# Altium schematic sheet LEDs_Switches.SchDoc: Evaluation Board 3.2
size A3; Organization: Toradex AG; Address1: Altsagenstrasse 5; Address2: Horw; Address3: 6048; Address4: Switzerland; DocumentNumber: 21; Revision: V3.2; SheetNumber: 21; SheetTotal: 23; PageSetup: Record=PageOptions|CenterHorizontal=True|CenterVertical=True|PrintScale=0.73|XCorrection=1.00|YCorrection=1.00|PrintKind=0|BorderSize=5000000|LeftOffset=0|BottomOffset=0|Orientation=2|PaperLength=1000|PaperWidth=1000|Scale=100|PaperSource=7|PrintQuality=-4|MediaType=1|DitherType=10|PaperKind=A4|PrintScaleMode=1
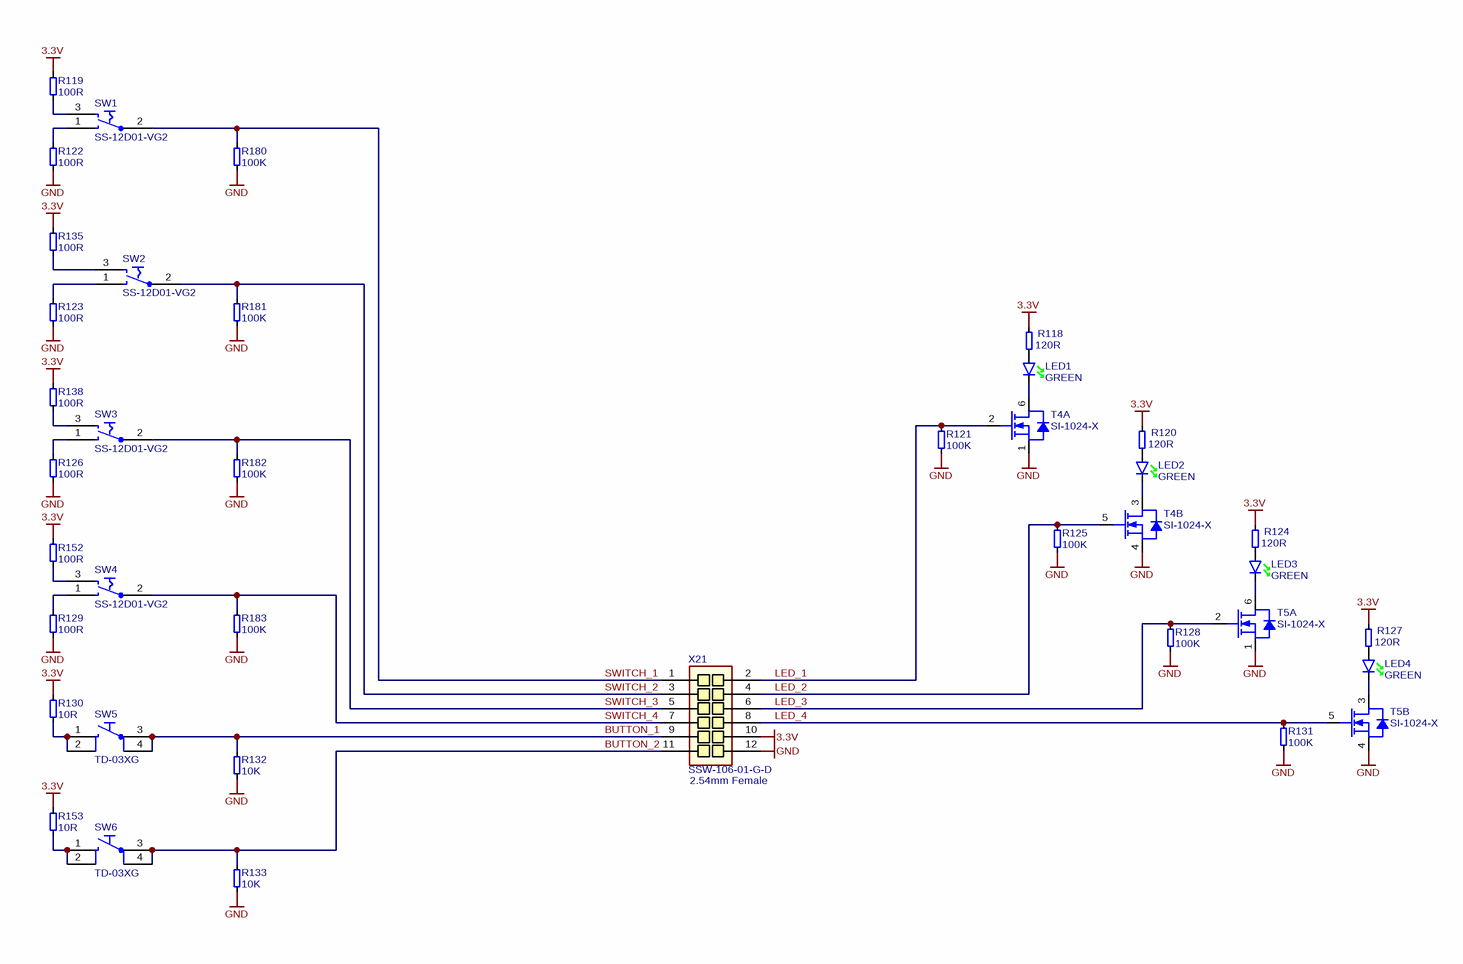
[diagram p0: LEDs_Switches.SchDoc]

## Parts
LED1  Color: GREEN  [T_Osram_T670_GREEN]  (hidden comment: LG T670-K1L2-1)
LED2  Color: GREEN  [T_Osram_T670_GREEN]  (hidden comment: LG T670-K1L2-1)
LED3  Color: GREEN  [T_Osram_T670_GREEN]  (hidden comment: LG T670-K1L2-1)
LED4  Color: GREEN  [T_Osram_T670_GREEN]  (hidden comment: LG T670-K1L2-1)
R118  120R  [T_RESC0603X30N]
R119  100R  [T_RESC0603X30N]
R120  120R  [T_RESC0603X30N]
R121  100K  [T_RESC0603X30N]
R122  100R  [T_RESC0603X30N]
R123  100R  [T_RESC0603X30N]
R124  120R  [T_RESC0603X30N]
R125  100K  [T_RESC0603X30N]
R126  100R  [T_RESC0603X30N]
R127  120R  [T_RESC0603X30N]
R128  100K  [T_RESC0603X30N]
R129  100R  [T_RESC0603X30N]
R130  10R  [T_RESC0603X30N]
R131  100K  [T_RESC0603X30N]
R132  10K  [T_RESC0603X30N]
R133  10K  [T_RESC0603X30N]
R135  100R  [T_RESC0603X30N]
R138  100R  [T_RESC0603X30N]
R152  100R  [T_RESC0603X30N]
R153  10R  [T_RESC0603X30N]
R180  100K  [T_RESC0603X30N]
R181  100K  [T_RESC0603X30N]
R182  100K  [T_RESC0603X30N]
R183  100K  [T_RESC0603X30N]
SW1  SS-12D01-VG2  [T_See-Plus_SS-12D01-VG2]
SW2  SS-12D01-VG2  [T_See-Plus_SS-12D01-VG2]
SW3  SS-12D01-VG2  [T_See-Plus_SS-12D01-VG2]
SW4  SS-12D01-VG2  [T_See-Plus_SS-12D01-VG2]
SW5  TD-03XG  [T_WMF_TD-03XG]
SW6  TD-03XG  [T_WMF_TD-03XG]
T4  Manufacturer Part No.: SI-1024-X  [SOTFL50P160X60-6N]  (hidden comment: T-Vishay-SI-1024X-N)  (parts A,B of 2)
T5  Manufacturer Part No.: SI-1024-X  [SOTFL50P160X60-6N]  (hidden comment: T-Vishay-SI-1024X-N)  (parts A,B of 2)
X21  SSW-106-01-G-D  [T_Samtec_SSW-106-01-G-D]

## Nets
3.3V: R118.2 R119.2 R120.2 R124.2 R127.2 R130.2 R135.2 R138.2 R152.2 R153.2 X21.10
GND: R121.1 R122.1 R123.1 R125.1 R126.1 R128.1 R129.1 R131.1 R132.1 R133.1 R180.1 R181.1 R182.1 R183.1 T4.1(S) T4.4(S) T5.1(S) T5.4(S) X21.12
BUTTON_1: R132.2 SW5.3 SW5.4 X21.9
BUTTON_2: R133.2 SW6.3 SW6.4 X21.11
LED_1: R121.2 T4.2(G) X21.2
LED_2: R125.2 T4.5(G) X21.4
LED_3: R128.2 T5.2(G) X21.6
LED_4: R131.2 T5.5(G) X21.8
SWITCH_1: R180.2 SW1.2 X21.1
SWITCH_2: R181.2 SW2.2 X21.3
SWITCH_3: R182.2 SW3.2 X21.5
SWITCH_4: R183.2 SW4.2 X21.7
NetLED1_A: LED1.A R118.1
NetLED1_K: LED1.K T4.6(D)
NetLED2_A: LED2.A R120.1
NetLED2_K: LED2.K T4.3(D)
NetLED3_A: LED3.A R124.1
NetLED3_K: LED3.K T5.6(D)
NetLED4_A: LED4.A R127.1
NetLED4_K: LED4.K T5.3(D)
NetR119_1: R119.1 SW1.3
NetR122_2: R122.2 SW1.1
NetR123_2: R123.2 SW2.1
NetR126_2: R126.2 SW3.1
NetR129_2: R129.2 SW4.1
NetR130_1: R130.1 SW5.1 SW5.2
NetR135_1: R135.1 SW2.3
NetR138_1: R138.1 SW3.3
NetR152_1: R152.1 SW4.3
NetR153_1: R153.1 SW6.1 SW6.2

## Notes on the sheet
- (near X21) 2.54mm Female
- Title
- Size:
- Date:
- A3
- Number:
- Time:
- Revision:
- Sheet
- of
- File:

## Library data of the parts
LED1-LED4 = LED-Osram-T670-K1L2-1: LED green Osram LG T670-K1L2-1; Manufacturer Part N.: LG T670-K1L2-1; Manufacturer Name: Osram
R118 R120 R124 R127 = R-120R-63mW-5%-0603: Resistor 120 ohm 63mW 5% 0603; Rating: 63mW; Tolerance: 5%; Value: 120R
R119 R122 R123 R126 R129 R135 R138 R152 = R-100R-63mW-5%-0603: Resistor 100 ohm 63mW 5% 0603; Rating: 63mW; Tolerance: 5%; Value: 100R
R121 R125 R128 R131 R180-R183 = R-100KR-63mW-5%-0603: Resistor 100 Kohm 63mW 5% 0603; Value: 100KR; Rating: 63mW; Tolerance: 5%
R130 R153 = R-10R-63mW-5%-0603: Resistor 10 ohm 63mW 5% 0603; Rating: 63mW; Tolerance: 5%; Value: 10R
R132 R133 = R-10KR-63mW-5%-0603: Resistor 10 Kohm 63mW 5% 0603; Value: 10KR; Rating: 63mW; Tolerance: 5%
SW1-SW4 = SW-See-Plus-SS-12D01-VG2: Switch; Rating: 0.3A; Manufacturer Name: See-Plus; Manufacturer Part No.: SS-12D01-VG2
SW5 SW6 = SW-WMF-TD-03XG: Switch; Manufacturer Name: WMF; Rating: 50mA; Manufacturer Part No.: TD-03XG
T4 T5 = T-Vishay-SI-1024X-N: Dual N-Channel 20V (D-S)  MOSFET; Manufacturer Name: Vishay
X21 = CON-Samtec-SSW-106-01-G-D: Header Female, 2x6 Pins, 2.54 mm pitch; Manufacturer Name: Samtec; Pitch: 2.54mm; No. of wasy: 2x6; Manufacturer Part No.: SSW-106-01-G-D